# EAGLE design EurocardBackplane-MCU (EAGLE 6.6.0)
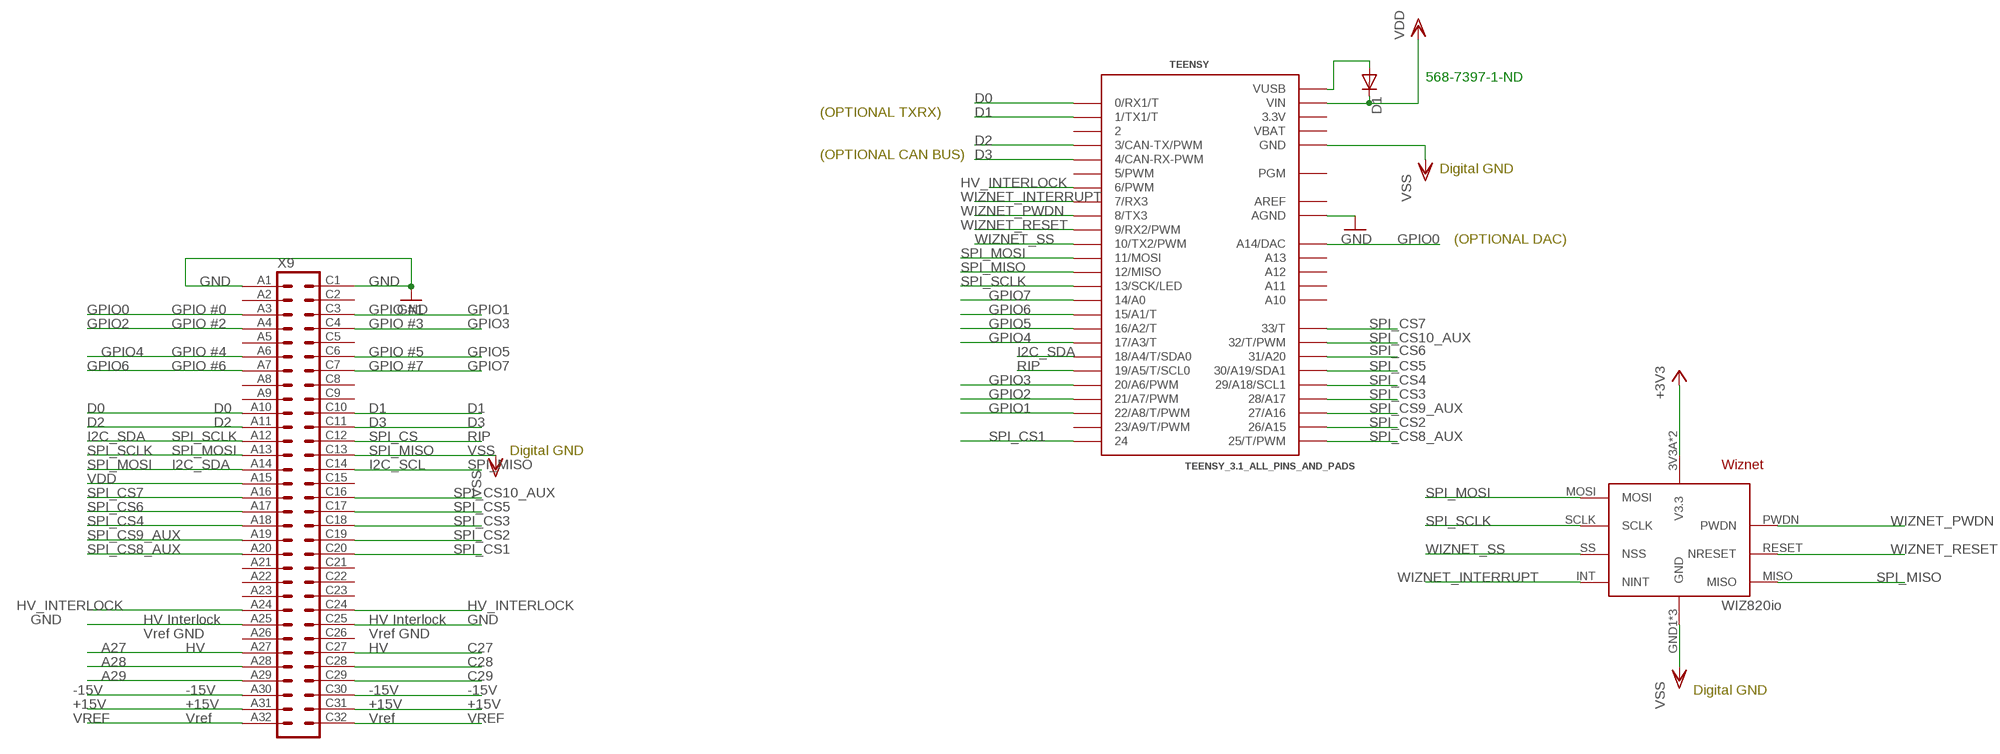
[diagram p0: schematic, sheet 1]

## Parts
D1  DIODE-SOD523  [SOD523]
TEENSY  TEENSY_3.1_ALL_PINS_AND_PADS  [TEENSY_3.1_ALLPINS]
U2  WIZ820IO  [WIZNET]
X9  VG64-PLAIN  [VG64-PLAIN]

## Nets
+3V3: U2.3V3A(V3.3) U2.3V3B(V3.3)
+15V: X9.A31 X9.C31
-15V: X9.A30 X9.C30
A27: X9.A27
A28: X9.A28
A29: X9.A29
C27: X9.C27
C28: X9.C28
C29: X9.C29
D0: TEENSY.0(0/RX1/T) X9.A10
D1: TEENSY.1(1/TX1/T) X9.C10
D2: TEENSY.3(3/CAN-TX/PWM) X9.A11
D3: TEENSY.4(4/CAN-RX-PWM) X9.C11
GND: TEENSY.AGND X9.A1 X9.A25 X9.C1 X9.C25
GPIO0: TEENSY.A14(A14/DAC) X9.A3
GPIO1: TEENSY.22/A8(22/A8/T/PWM) X9.C3
GPIO2: TEENSY.21/A7(21/A7/PWM) X9.A4
GPIO3: TEENSY.20/A6(20/A6/PWM) X9.C4
GPIO4: TEENSY.17/A3(17/A3/T) X9.A6
GPIO5: TEENSY.16/A2(16/A2/T) X9.C6
GPIO6: TEENSY.15/A1(15/A1/T) X9.A7
GPIO7: TEENSY.14/A0 X9.C7
HV_INTERLOCK: TEENSY.6(6/PWM) X9.A24 X9.C24
I2C_SDA: TEENSY.18/A4(18/A4/T/SDA0) X9.A12
N$2: D1.A TEENSY.VUSB
RIP: TEENSY.19/A5(19/A5/T/SCL0) X9.C12
SPI_CS1: TEENSY.24 X9.C20
SPI_CS2: TEENSY.26(26/A15) X9.C19
SPI_CS3: TEENSY.28(28/A17) X9.C18
SPI_CS4: TEENSY.29(29/A18/SCL1) X9.A18
SPI_CS5: TEENSY.30(30/A19/SDA1) X9.C17
SPI_CS6: TEENSY.31(31/A20) X9.A17
SPI_CS7: TEENSY.33(33/T) X9.A16
SPI_CS8_AUX: TEENSY.25(25/T/PWM) X9.A20
SPI_CS9_AUX: TEENSY.27(27/A16) X9.A19
SPI_CS10_AUX: TEENSY.32(32/T/PWM) X9.C16
SPI_MISO: TEENSY.12(12/MISO) U2.MISO X9.C14
SPI_MOSI: TEENSY.11(11/MOSI) U2.MOSI X9.A14
SPI_SCLK: TEENSY.13(13/SCK/LED) U2.SCLK X9.A13
VDD: D1.C TEENSY.VIN X9.A15
VREF: X9.A32 X9.C32
VSS: TEENSY.GND TEENSY.GND1(GND) TEENSY.GND2(GND) U2.GND1(GND) U2.GND2(GND) U2.GND3(GND) X9.C13
WIZNET_INTERRUPT: TEENSY.7(7/RX3) U2.INT(NINT)
WIZNET_PWDN: TEENSY.8(8/TX3) U2.PWDN
WIZNET_RESET: TEENSY.9(9/RX2/PWM) U2.RESET(NRESET)
WIZNET_SS: TEENSY.10(10/TX2/PWM) U2.SS(NSS)
Unconnected: TEENSY.2 TEENSY.5(5/PWM) TEENSY.23/A9(23/A9/T/PWM) TEENSY.A10 TEENSY.A11 TEENSY.A12 TEENSY.A13 TEENSY.PGM X9.A2 X9.A5 X9.A8 X9.A9 X9.A21 X9.A22 X9.A23 X9.A26 X9.C2 X9.C5 X9.C8 X9.C9 X9.C15 X9.C21 X9.C22 X9.C23 X9.C26

## Notes on the sheet
- 568-7397-1-ND
- (OPTIONAL TXRX)
- (OPTIONAL CAN BUS)
- Digital GND
- (OPTIONAL DAC)
- Digital GND
- Digital GND

## Power pins joined to a net without a drawn wire
3.3V: TEENSY.3.3V TEENSY.3.3V1(3.3V) TEENSY.3.3V2(3.3V)
AREF: TEENSY.AREF
VBAT: TEENSY.VBAT

## Library data of the parts
D1 = diode:DIODE-: DIODE
TEENSY = mcu-accessories:TEENSY_3.1_ALL_PINS_AND_PADS: Footprint for Teensy 3.1 board using all pads and all through-holes. Pads need a 2x7 0.1" SMD header.
U2 = mcu-accessories:WIZ820IO: WIZNET ethernet eval board
X9 = Eurocard-Backplane-jqi:VG64: PCB EUROCARD, 64-pin type C/AC, 2.54 mm Typically use package VG64P.

## Board
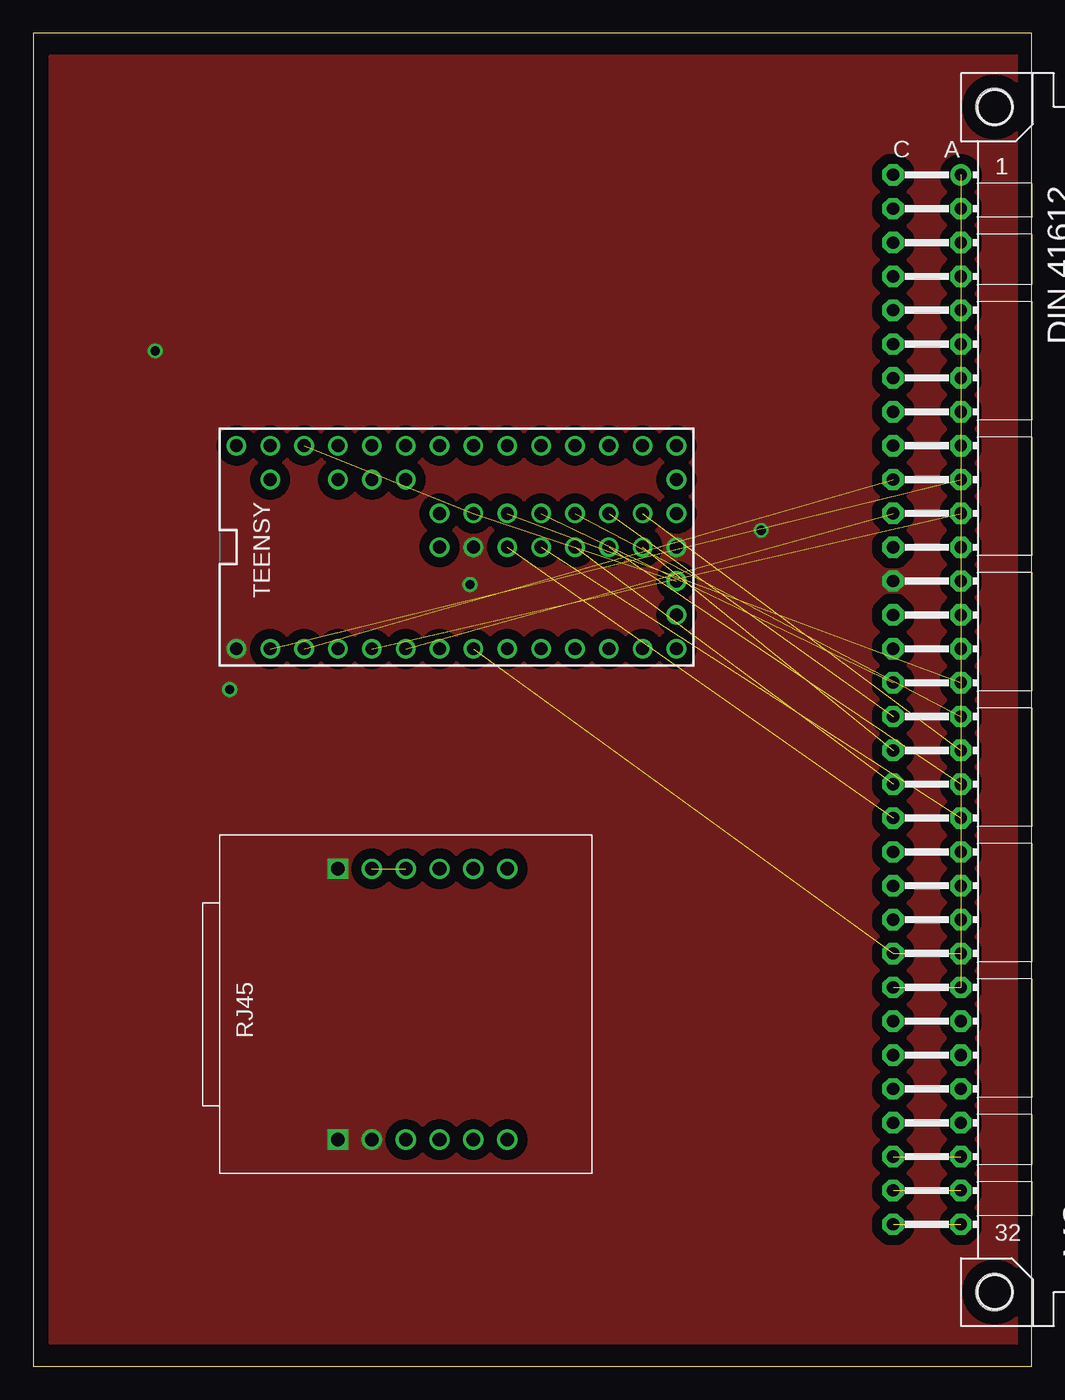
[diagram p1: board, top side]
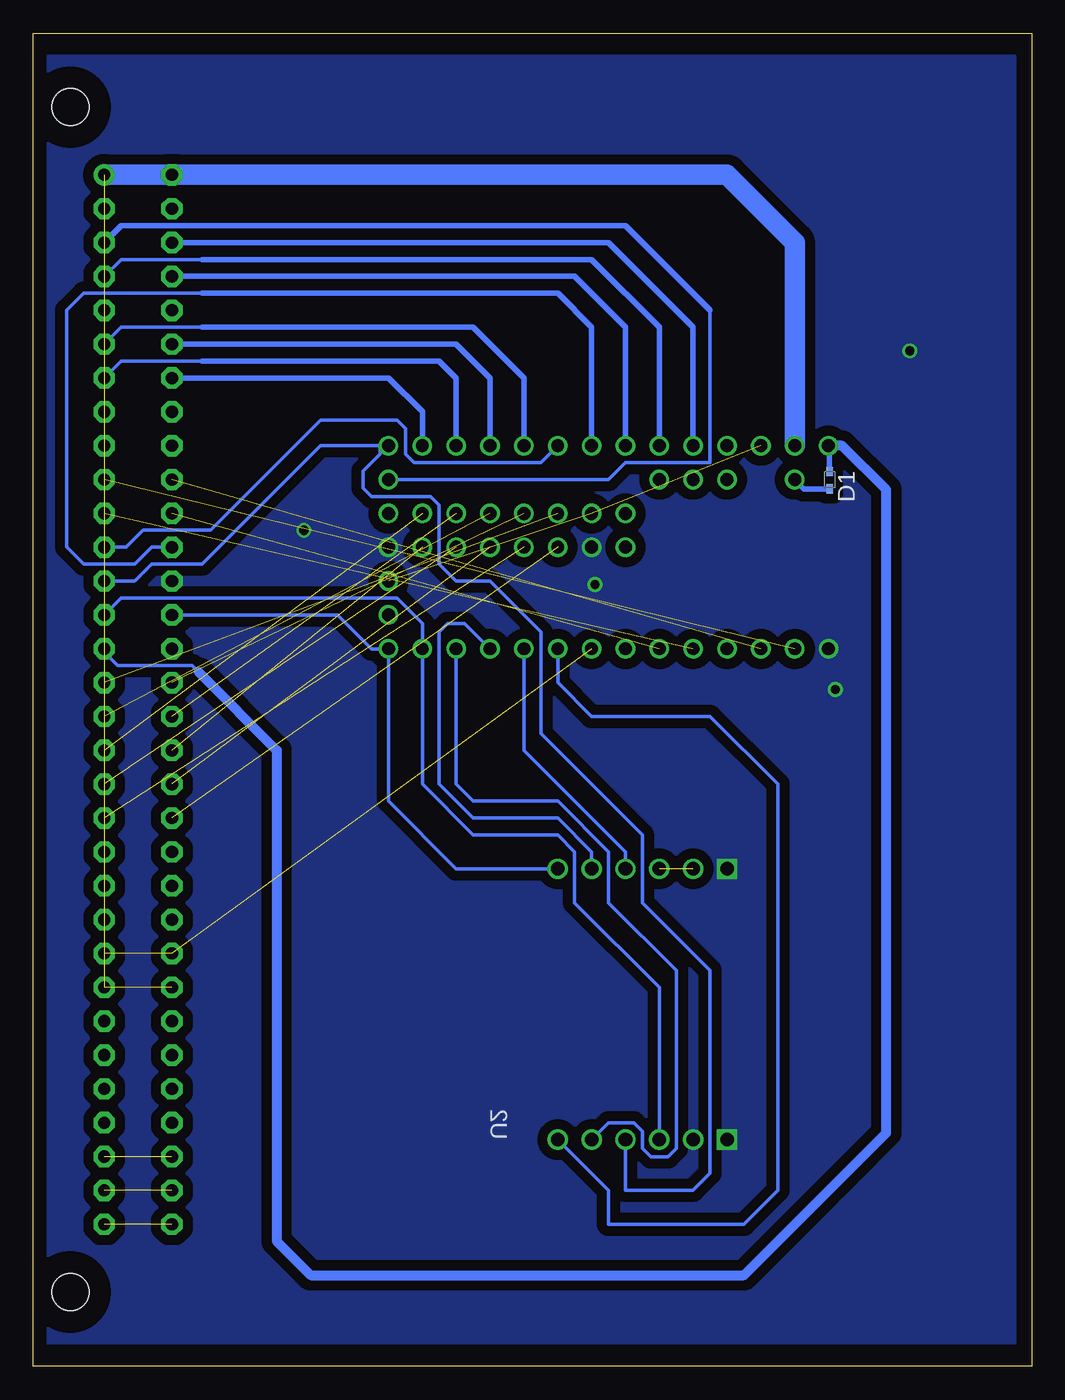
[diagram p2: board, bottom side, seen from below]

Size 74.91 x 100 mm. Coordinates in mm from the lower left corner, seen from the top.
Outline: 0,0 74.91,0 74.91,100 0,100 0,0
Copper layers (1*16): Top 0.035mm / dielectric 1.5mm / Bottom 0.035mm
Design rules "default": minimum track width 10mil, minimum drill 24mil, track to track 8mil, track to pad 8mil, pad to pad 8mil, via to via 8mil, smd to smd 8mil, copper to edge 40mil, drill to drill 8mil, minimum pad ring 10mil, minimum via ring 8mil, stop-mask expansion 4mil, vias tented up to drill 0mil, thermal gap 10mil

### Footprints (pad centres in the part's own frame; a part is rotated, then mirrored left to right if it is on the bottom)
SOD523 = smd 0.7 x 0.5: A 0.7,0; C -0.6,0
TEENSY_3.1_ALLPINS = drill 0.965: 0 -7.62,15.24; 1 -7.62,12.7; 2 -7.62,10.16; 3 -7.62,7.62; 3.3V 7.62,12.7; 3.3V1 -2.54,-15.24; 3.3V2 2.54,0; 4 -7.62,5.08; 5 -7.62,2.54; 6 -7.62,0; 7 -7.62,-2.54; 8 -7.62,-5.08; 9 -7.62,-7.62; 10 -7.62,-10.16; 11 -7.62,-12.7; 12 -7.62,-15.24; 13 7.62,-15.24; 14/A0 7.62,-12.7; 15/A1 7.62,-10.16; 16/A2 7.62,-7.62; 17/A3 7.62,-5.08; 18/A4 7.62,-2.54; 19/A5 7.62,0; 20/A6 7.62,2.54; 21/A7 7.62,5.08; 22/A8 7.62,7.62; 23/A9 7.62,10.16; 24 0,-2.54; 25 0,-5.08; 26 0,-7.62; 27 0,-10.16; 28 0,-12.7; 29 2.54,-12.7; 30 2.54,-10.16; 31 2.54,-7.62; 32 2.54,-5.08; 33 2.54,-2.54; A10 5.08,7.62; A11 5.08,5.08; A12 0,2.54; A13 2.54,2.54; A14 5.08,-15.24; AGND 7.62,15.24; AREF 5.08,10.16; GND -7.62,17.78; GND1 0,-15.24; GND2 0,0; PGM 2.54,-15.24; VBAT -5.08,-15.24; VIN 7.62,17.78; VUSB 5.08,15.24
WIZNET = drill 1.016: 3V3A 10.16,5.08; 3V3B 10.16,2.54; GND2 -10.16,5.08; INT -10.16,-5.08; MISO 10.16,-5.08; MOSI -10.16,2.54; PWDN 10.16,0; RESET 10.16,-2.54; SCLK -10.16,0; SS -10.16,-2.54 | drill 1.016 square: GND1 -10.16,7.62; GND3 10.16,7.62
VG64-PLAIN = drill 0.914 pad 1.6: A1 -5.334,89.383 | drill 0.914 pad 1.6 octagon: A2 -5.334,86.843; A3 -5.334,84.303; A4 -5.334,81.763; A5 -5.334,79.223; A6 -5.334,76.683; A7 -5.334,74.143; A8 -5.334,71.603; A9 -5.334,69.063; A10 -5.334,66.523; A11 -5.334,63.983; A12 -5.334,61.443; A13 -5.334,58.903; A14 -5.334,56.363; A15 -5.334,53.823; A16 -5.334,51.283; A17 -5.334,48.743; A18 -5.334,46.203; A19 -5.334,43.663; A20 -5.334,41.123; A21 -5.334,38.583; A22 -5.334,36.043; A23 -5.334,33.503; A24 -5.334,30.963; A25 -5.334,28.423; A26 -5.334,25.883; A27 -5.334,23.343; A28 -5.334,20.803; A29 -5.334,18.263; A30 -5.334,15.723; A31 -5.334,13.183; A32 -5.334,10.643; C1 -10.414,89.383; C2 -10.414,86.843; C3 -10.414,84.303; C4 -10.414,81.763; C5 -10.414,79.223; C6 -10.414,76.683; C7 -10.414,74.143; C8 -10.414,71.603; C9 -10.414,69.063; C10 -10.414,66.523; C11 -10.414,63.983; C12 -10.414,61.443; C13 -10.414,58.903; C14 -10.414,56.363; C15 -10.414,53.823; C16 -10.414,51.283; C17 -10.414,48.743; C18 -10.414,46.203; C19 -10.414,43.663; C20 -10.414,41.123; C21 -10.414,38.583; C22 -10.414,36.043; C23 -10.414,33.503; C24 -10.414,30.963; C25 -10.414,28.423; C26 -10.414,25.883; C27 -10.414,23.343; C28 -10.414,20.803; C29 -10.414,18.263; C30 -10.414,15.723; C31 -10.414,13.183; C32 -10.414,10.643 | hole 2.794: -2.794,94.463; -2.794,5.563

### Placement (x,y rotation side)
D1  15.16,66.52 270 bottom
TEENSY  33.02,61.44 90 top
U2  30.48,27.15 90 top
X9  74.93,0 0 top

### Tracks (layer width: path | path; a pad name or v marks a point on that pad's centre or on a via)
3.3V  (2 unrouted)
+3V3  (1 unrouted)
+15V  (1 unrouted)
-15V  (1 unrouted)
D0  (1 unrouted)
D1  (1 unrouted)
D2  (1 unrouted)
D3  (1 unrouted)
GND  (2 unrouted)
  Bottom 1.524: TEENSY.AGND 17.78,84.3 22.86,89.38 X9.C1 X9.A1
GPIO0
  Bottom 0.254: 24.13,79.22 24.13,67.79 30.48,67.79 31.75,66.52 TEENSY.A14
  Bottom 0.406: 24.13,79.22 30.48,85.57 68.33,85.57 X9.A3
GPIO1
  Bottom 0.406: X9.C3 31.75,84.3 25.4,77.95 TEENSY.22/A8
GPIO2
  Bottom 0.254: 62.23,83.03 68.33,83.03 X9.A4
  Bottom 0.406: TEENSY.21/A7 27.94,77.95 33.02,83.03 62.23,83.03
GPIO3
  Bottom 0.406: TEENSY.20/A6 30.48,77.95 34.29,81.76 X9.C4
GPIO4
  Bottom 0.254: 62.23,77.95 68.33,77.95 X9.A6
  Bottom 0.406: TEENSY.17/A3 38.1,74.14 41.91,77.95 62.23,77.95
GPIO5
  Bottom 0.406: TEENSY.16/A2 40.64,74.14 43.18,76.68 X9.C6
GPIO6
  Bottom 0.254: 62.23,75.41 68.33,75.41 X9.A7
  Bottom 0.406: TEENSY.15/A1 43.18,74.14 44.45,75.41 62.23,75.41
GPIO7
  Bottom 0.406: TEENSY.14/A0 45.72,71.6 48.26,74.14 X9.C7
HV_INTERLOCK  (2 unrouted)
I2C_SDA
  Bottom 0.254: TEENSY.18/A4 36.83,67.79 46.35,67.79 46.99,68.43 46.99,70.33 47.62,70.97 53.34,70.97 61.59,62.71 66.67,62.71 67.94,61.44 X9.A12
N$2
  Bottom 0.406: TEENSY.VUSB 17.08,65.82 D1.A
RIP
  Bottom 0.254: 62.23,80.49 71.12,80.49 72.39,79.22 72.39,61.44 71.12,60.17 67.31,60.17 66.04,61.44 X9.C12
  Bottom 0.406: TEENSY.19/A5 33.02,77.95 35.56,80.49 62.23,80.49
SPI_CS1  (1 unrouted)
SPI_CS2  (1 unrouted)
SPI_CS3  (1 unrouted)
SPI_CS4  (1 unrouted)
SPI_CS5  (1 unrouted)
SPI_CS6  (1 unrouted)
SPI_CS7  (1 unrouted)
SPI_CS8_AUX  (1 unrouted)
SPI_CS9_AUX  (1 unrouted)
SPI_CS10_AUX  (1 unrouted)
SPI_MISO
  Bottom 0.254: U2.MISO 43.18,37.31 48.26,42.39 TEENSY.12 49.53,53.82 52.07,56.36 X9.C14
SPI_MOSI
  Bottom 0.254: U2.MOSI 27.94,28.42 34.29,34.77 34.29,38.58 35.56,39.85 41.91,39.85 45.72,43.66 TEENSY.11 45.72,55.73 47.62,57.63 68.33,57.63 X9.A14
SPI_SCLK
  Bottom 0.254: U2.SCLK 30.48,13.18 25.4,13.18 24.13,14.45 24.13,29.69 29.21,34.77 29.21,39.85 36.83,47.47 36.83,55.09 40.64,58.9 43.18,58.9 44.45,60.17 44.45,64.62 45.09,65.25 49.53,65.25 50.16,65.89 50.16,67.16 48.9,68.43 48.9,69.06 | 48.26,68.43 TEENSY.13 48.9,69.06 | 48.9,69.06 53.34,69.06 62.23,60.17 66.04,60.17 67.31,58.9 X9.A13
VDD
  Bottom 0.254: X9.A15 69.6,53.57 68.58,52.55 62.99,52.55 62.48,52.04
  Bottom 0.406: TEENSY.VIN 15.16,68.99 D1.C
  Bottom 0.762: 62.48,52.04 56.64,46.2 56.64,9.37 54.1,6.83 21.59,6.83 10.92,17.5 10.92,65.76 14.22,69.06 TEENSY.VIN
VREF  (1 unrouted)
VSS  (via drill 0.7)
  other vias: 54.61,62.71 32.77,58.65 14.73,50.77 9.14,76.17
  pour Bottom (isolate 0.762, no thermals): 1.27,98.27 74.93,98.27 74.93,1.75 1.27,1.75
  pour Top (isolate 0.762, no thermals): 74.93,1.75 1.27,1.75 1.27,98.27 74.93,98.27
WIZNET_INTERRUPT
  Bottom 0.254: U2.INT 31.75,13.18 31.75,10.64 21.59,10.64 19.05,13.18 19.05,43.66 24.13,48.74 33.02,48.74 35.56,51.28 TEENSY.7
WIZNET_PWDN
  Bottom 0.254: U2.PWDN 30.48,38.58 38.1,46.2 TEENSY.8
WIZNET_RESET
  Bottom 0.254: U2.RESET 33.02,38.58 35.56,41.12 41.91,41.12 44.45,43.66 44.45,55.09 43.81,55.73 42.55,55.73 TEENSY.9
WIZNET_SS
  Bottom 0.254: U2.SS 31.75,18.26 29.84,18.26 29.21,17.63 29.21,16.36 28.58,15.72 27.3,15.72 26.67,16.36 26.67,29.69 31.75,34.77 31.75,38.58 35.56,42.39 41.91,42.39 43.18,43.66 TEENSY.10